# EAGLE design universal front plate final (EAGLE 7.6.0)
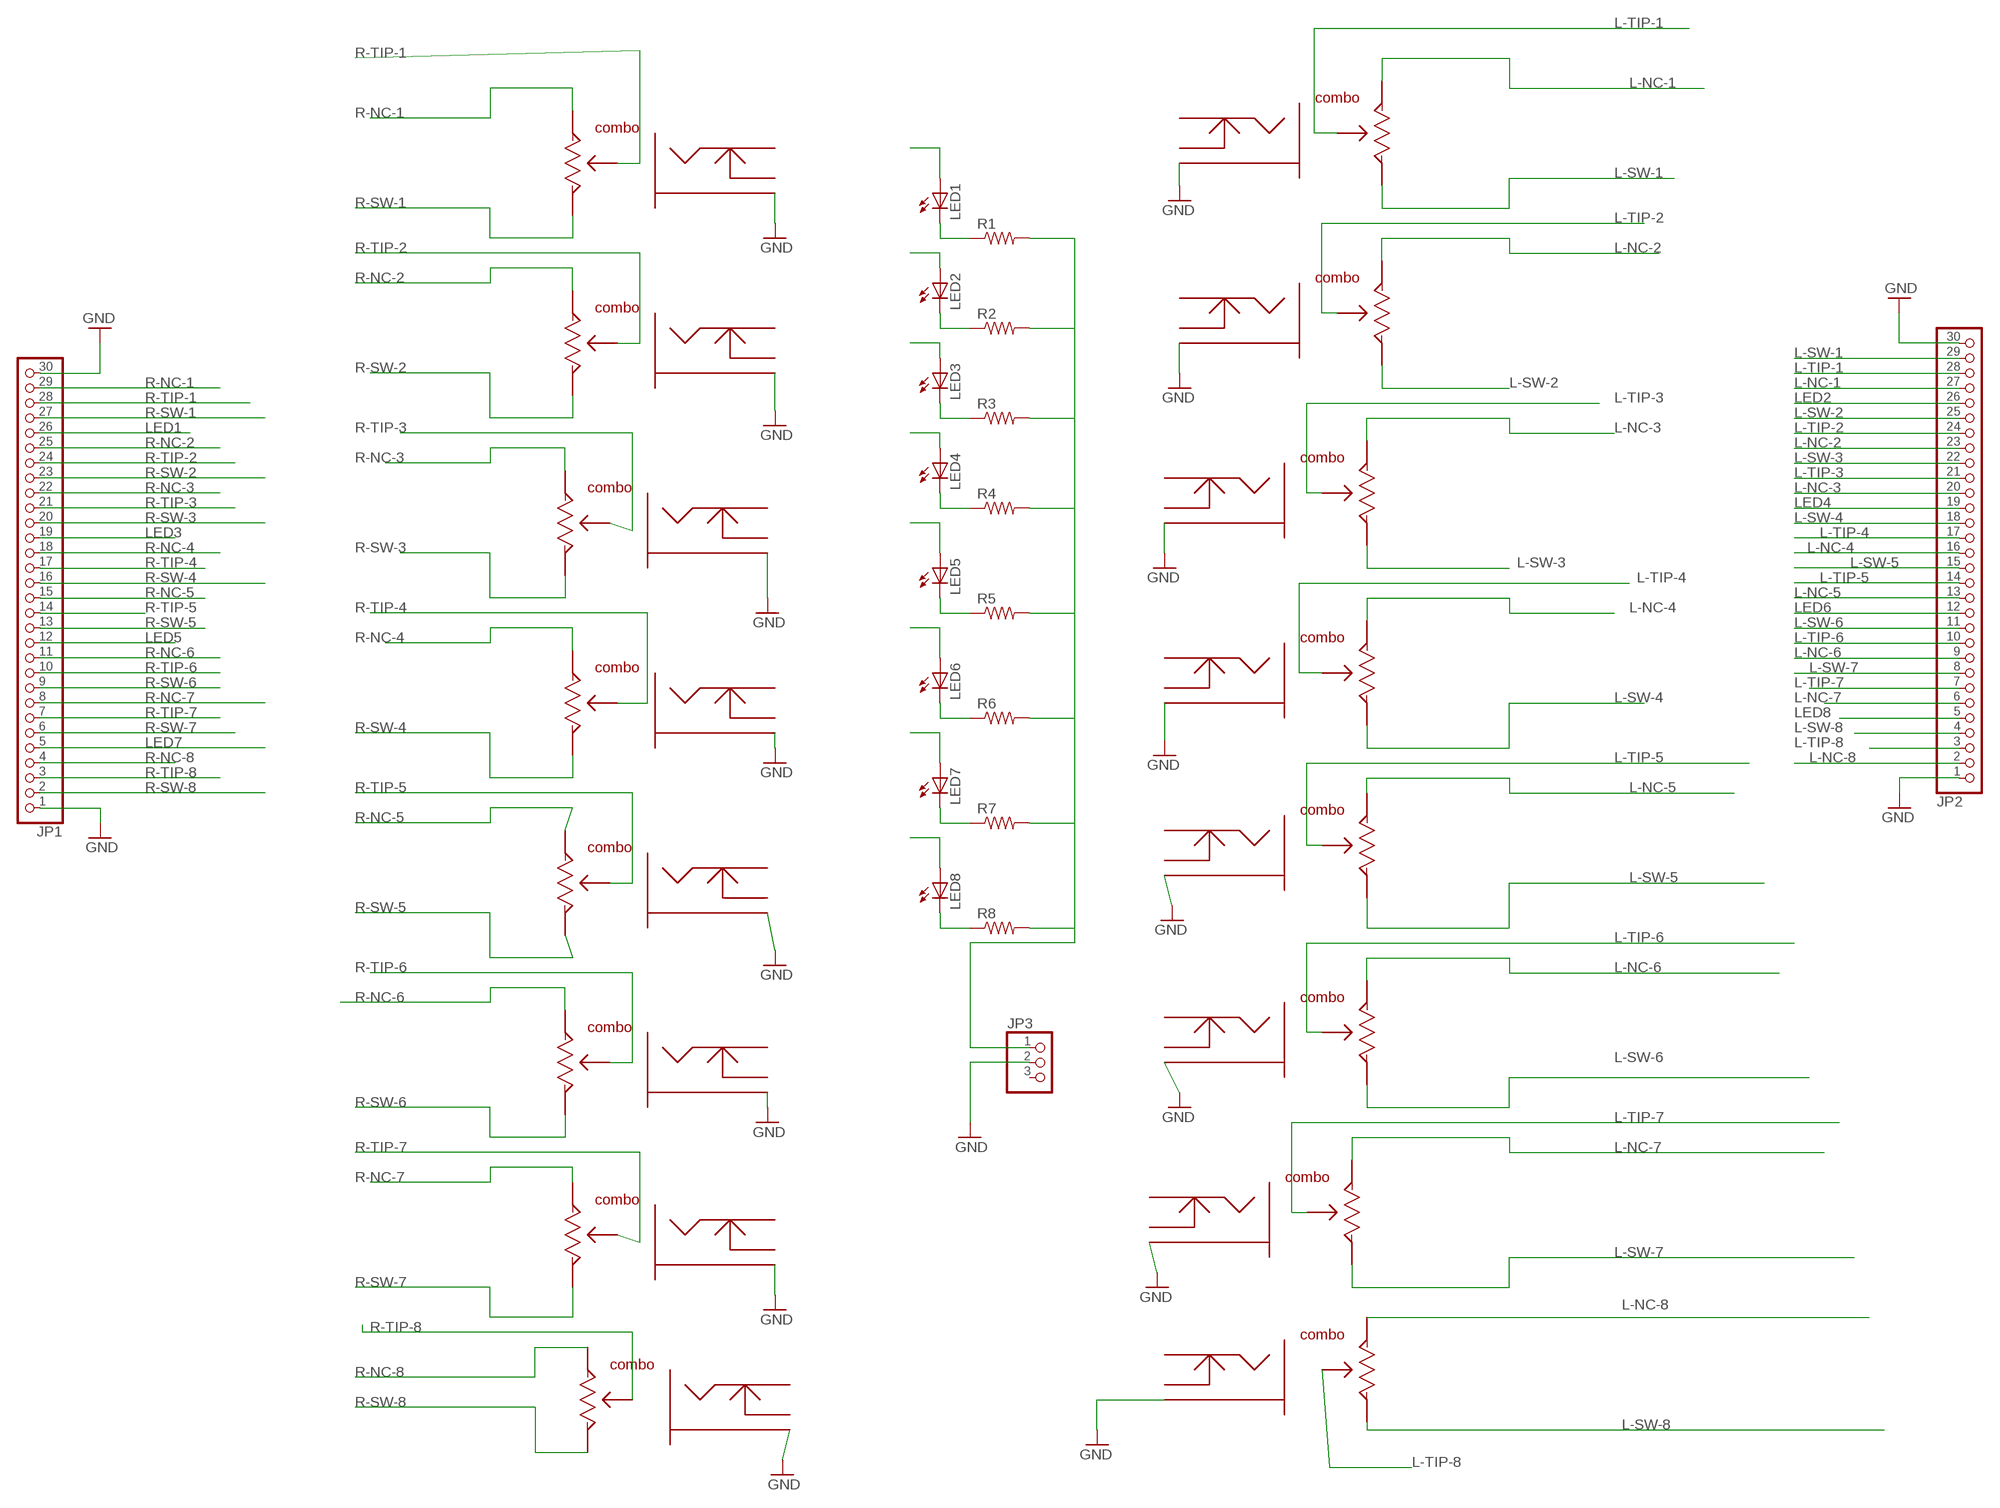
[diagram p0: schematic, sheet 1]

## Parts
JP1  PINHD-1X30  [1X30]
JP2  PINHD-1X30  [1X30]
JP3  PINHD-1X3  [1X03]
LED1  LED3MM  [LED3MM]
LED2  LED3MM  [LED3MM]
LED3  LED3MM  [LED3MM]
LED4  LED3MM  [LED3MM]
LED5  LED3MM  [LED3MM]
LED6  LED3MM  [LED3MM]
LED7  LED3MM  [LED3MM]
LED8  LED3MM  [LED3MM]
R1  R-US_0204/5  [0204/5]
R2  R-US_0204/5  [0204/5]
R3  R-US_0204/5  [0204/5]
R4  R-US_0204/5  [0204/5]
R5  R-US_0204/5  [0204/5]
R6  R-US_0204/5  [0204/5]
R7  R-US_0204/5  [0204/5]
R8  R-US_0204/5  [0204/5]
U$1  KOBICON-COMBO-NEW  [KOBICON-COMBO-NEW]
U$2  KOBICON-COMBO-NEW  [KOBICON-COMBO-NEW]
U$3  KOBICON-COMBO-NEW  [KOBICON-COMBO-NEW]
U$4  KOBICON-COMBO-NEW  [KOBICON-COMBO-NEW]
U$5  KOBICON-COMBO-NEW  [KOBICON-COMBO-NEW]
U$6  KOBICON-COMBO-NEW  [KOBICON-COMBO-NEW]
U$7  KOBICON-COMBO-NEW  [KOBICON-COMBO-NEW]
U$8  KOBICON-COMBO-NEW  [KOBICON-COMBO-NEW]
U$9  KOBICON-COMBO-NEW  [KOBICON-COMBO-NEW]
U$10  KOBICON-COMBO-NEW  [KOBICON-COMBO-NEW]
U$11  KOBICON-COMBO-NEW  [KOBICON-COMBO-NEW]
U$12  KOBICON-COMBO-NEW  [KOBICON-COMBO-NEW]
U$13  KOBICON-COMBO-NEW  [KOBICON-COMBO-NEW]
U$14  KOBICON-COMBO-NEW  [KOBICON-COMBO-NEW]
U$15  KOBICON-COMBO-NEW  [KOBICON-COMBO-NEW]
U$16  KOBICON-COMBO-NEW  [KOBICON-COMBO-NEW]

## Nets
GND: JP1.1 JP1.30 JP2.1 JP2.30 JP3.2 U$1.GND2(JACK-GND) U$1.GND(JACK-GND) U$2.GND2(JACK-GND) U$2.GND(JACK-GND) U$3.GND2(JACK-GND) U$3.GND(JACK-GND) U$4.GND2(JACK-GND) U$4.GND(JACK-GND) U$5.GND2(JACK-GND) U$5.GND(JACK-GND) U$6.GND2(JACK-GND) U$6.GND(JACK-GND) U$7.GND2(JACK-GND) U$7.GND(JACK-GND) U$8.GND2(JACK-GND) U$8.GND(JACK-GND) U$9.GND2(JACK-GND) U$9.GND(JACK-GND) U$10.GND2(JACK-GND) U$10.GND(JACK-GND) U$11.GND2(JACK-GND) U$11.GND(JACK-GND) U$12.GND2(JACK-GND) U$12.GND(JACK-GND) U$13.GND2(JACK-GND) U$13.GND(JACK-GND) U$14.GND2(JACK-GND) U$14.GND(JACK-GND) U$15.GND2(JACK-GND) U$15.GND(JACK-GND) U$16.GND2(JACK-GND) U$16.GND(JACK-GND)
L-NC-1: JP2.27 U$8.JACK-MID(POT-L) U$8.POT-L
L-NC-2: JP2.23 U$9.JACK-MID(POT-L) U$9.POT-L
L-NC-3: JP2.20 U$10.JACK-MID(POT-L) U$10.POT-L
L-NC-4: JP2.16 U$11.JACK-MID(POT-L) U$11.POT-L
L-NC-5: JP2.13 U$12.JACK-MID(POT-L) U$12.POT-L
L-NC-6: JP2.9 U$13.JACK-MID(POT-L) U$13.POT-L
L-NC-7: JP2.6 U$14.JACK-MID(POT-L) U$14.POT-L
L-NC-8: JP2.2 U$15.JACK-MID(POT-L) U$15.POT-L
L-SW-1: JP2.29 U$8.JACK-BOT(POT-R) U$8.POT-R
L-SW-2: JP2.25 U$9.JACK-BOT(POT-R) U$9.POT-R
L-SW-3: JP2.22 U$10.JACK-BOT(POT-R) U$10.POT-R
L-SW-4: JP2.18 U$11.JACK-BOT(POT-R) U$11.POT-R
L-SW-5: JP2.15 U$12.JACK-BOT(POT-R) U$12.POT-R
L-SW-6: JP2.11 U$13.JACK-BOT(POT-R) U$13.POT-R
L-SW-7: JP2.8 U$14.JACK-BOT(POT-R) U$14.POT-R
L-SW-8: JP2.4 U$15.JACK-BOT(POT-R) U$15.POT-R
L-TIP-1: JP2.28 U$8.JACK-TOP(POT-MID) U$8.POT-MID
L-TIP-2: JP2.24 U$9.JACK-TOP(POT-MID) U$9.POT-MID
L-TIP-3: JP2.21 U$10.JACK-TOP(POT-MID) U$10.POT-MID
L-TIP-4: JP2.17 U$11.JACK-TOP(POT-MID) U$11.POT-MID
L-TIP-5: JP2.14 U$12.JACK-TOP(POT-MID) U$12.POT-MID
L-TIP-6: JP2.10 U$13.JACK-TOP(POT-MID) U$13.POT-MID
L-TIP-7: JP2.7 U$14.JACK-TOP(POT-MID) U$14.POT-MID
L-TIP-8: JP2.3 U$15.JACK-TOP(POT-MID) U$15.POT-MID
LED1: JP1.26 LED1.A
LED2: JP2.26 LED2.A
LED3: JP1.19 LED3.A
LED4: JP2.19 LED4.A
LED5: JP1.12 LED5.A
LED6: JP2.12 LED6.A
LED7: JP1.5 LED7.A
LED8: JP2.5 LED8.A
N$1: LED8.K(C) R8.1
N$3: JP3.1 R1.2 R2.2 R3.2 R4.2 R5.2 R6.2 R7.2 R8.2
N$22: LED1.K(C) R1.1
N$30: LED2.K(C) R2.1
N$32: LED3.K(C) R3.1
N$33: LED4.K(C) R4.1
N$36: LED5.K(C) R5.1
N$38: LED6.K(C) R6.1
N$40: LED7.K(C) R7.1
R-NC-1: JP1.29 U$1.JACK-MID(POT-L) U$1.POT-L
R-NC-2: JP1.25 U$2.JACK-MID(POT-L) U$2.POT-L
R-NC-3: JP1.22 U$3.JACK-MID(POT-L) U$3.POT-L
R-NC-4: JP1.18 U$4.JACK-MID(POT-L) U$4.POT-L
R-NC-5: JP1.15 U$5.JACK-MID(POT-L) U$5.POT-L
R-NC-6: JP1.11 U$6.JACK-MID(POT-L) U$6.POT-L
R-NC-7: JP1.8 U$7.JACK-MID(POT-L) U$7.POT-L
R-NC-8: JP1.4 U$16.JACK-MID(POT-L) U$16.POT-L
R-SW-1: JP1.27 U$1.JACK-BOT(POT-R) U$1.POT-R
R-SW-2: JP1.23 U$2.JACK-BOT(POT-R) U$2.POT-R
R-SW-3: JP1.20 U$3.JACK-BOT(POT-R) U$3.POT-R
R-SW-4: JP1.16 U$4.JACK-BOT(POT-R) U$4.POT-R
R-SW-5: JP1.13 U$5.JACK-BOT(POT-R) U$5.POT-R
R-SW-6: JP1.9 U$6.JACK-BOT(POT-R) U$6.POT-R
R-SW-7: JP1.6 U$7.JACK-BOT(POT-R) U$7.POT-R
R-SW-8: JP1.2 U$16.JACK-BOT(POT-R) U$16.POT-R
R-TIP-1: JP1.28 U$1.JACK-TOP(POT-MID) U$1.POT-MID
R-TIP-2: JP1.24 U$2.JACK-TOP(POT-MID) U$2.POT-MID
R-TIP-3: JP1.21 U$3.JACK-TOP(POT-MID) U$3.POT-MID
R-TIP-4: JP1.17 U$4.JACK-TOP(POT-MID) U$4.POT-MID
R-TIP-5: JP1.14 U$5.JACK-TOP(POT-MID) U$5.POT-MID
R-TIP-6: JP1.10 U$6.JACK-TOP(POT-MID) U$6.POT-MID
R-TIP-7: JP1.7 U$7.JACK-TOP(POT-MID) U$7.POT-MID
R-TIP-8: JP1.3 U$16.JACK-TOP(POT-MID) U$16.POT-MID
Unconnected: JP3.3

## Library data of the parts
JP1 JP2 = pinhead:PINHD-1X30: PIN HEADER
JP3 = pinhead:PINHD-1X3: PIN HEADER
LED1-LED8 = led:LED: LED OSRAM: - CHIPLED LG R971, LG N971, LY N971, LG Q971, LY Q971, LO R971, LY R971 LH N974, LH R974 LS Q976, LO Q976, LY Q976 LO Q996 - Hyper CHIPLED LW Q18S LB Q993, LB Q99A, LB R99A - SideLED LS A670, LO A670, LY A670, LG A670, LP A670 LB A673, LV A673, LT A673, LW A673 LH A674 LY A675 LS A676, LA A676, LO A676, LY A676, LW A676 LS A679, LY A679, LG A679 - Hyper Micro SIDELED® LS Y876, LA Y876, LO Y876, LY Y876 LT Y87S - SmartLED LW L88C, LW L88S LB L89C, LB L89S, LG L890 LS L89K, LO L89K, LY L89K LS L896, LA L896, LO L896, LY L896 - TOPLED LS T670, LO T670, LY T670, LG T670, LP T670 LSG T670, LSP T670, LSY T670, LOP T670, LYG T670 LG T671, LOG T671, LSG T671 LB T673, LV T673, LT T673, LW T673 LH T674 LS T676, LA T676, LO T676, LY T676, LB T676, LH T676, LSB T676, LW T676 LB T67C, LV T67C, LT T67C, LS T67K, LO T67K, LY T67K, LW E67C LS E67B, LA E67B, LO E67B, LY E67B, LB E67C, LV E67C, LT E67C LW T67C LS T679, LY T679, LG T679 LS T770, LO T770, LY T770, LG T770, LP T770 LB T773, LV T773, LT T773, LW T773 LH T774 LS E675, LA E675, LY E675, LS T675 LS T776, LA T776, LO T776, LY T776, LB T776 LHGB T686 LT T68C, LB T68C - Hyper Mini TOPLED® LB M676 - Mini TOPLED Santana® LG M470 LS M47K, LO M47K, LY M47K Source: http://www.osram.convergy.de LUXEON: - LUMILED® LXK2-PW12-R00, LXK2-PW12-S00, LXK2-PW14-U00, LXK2-PW14-V00 LXK2-PM12-R00, LXK2-PM12-S00, LXK2-PM14-U00 LXK2-PE12-Q00, LXK2-PE12-R00, LXK2-PE12-S00, LXK2-PE14-T00, LXK2-PE14-U00 LXK2-PB12-K00, LXK2-PB12-L00, LXK2-PB12-M00, LXK2-PB14-N00, LXK2-PB14-P00, LXK2-PB14-Q00 LXK2-PR12-L00, LXK2-PR12-M00, LXK2-PR14-Q00, LXK2-PR14-R00 LXK2-PD12-Q00, LXK2-PD12-R00, LXK2-PD12-S00 LXK2-PH12-R00, LXK2-PH12-S00 LXK2-PL12-P00, LXK2-PL12-Q00, LXK2-PL12-R00 Source: www.luxeon.com KINGBRIGHT: KA-3528ASYC Source: www.kingbright.com
R1-R8 = rcl:R-US_: RESISTOR, American symbol
U$1-U$16 = elipech_modified:KOBICON-COMBO-NEW

## Board
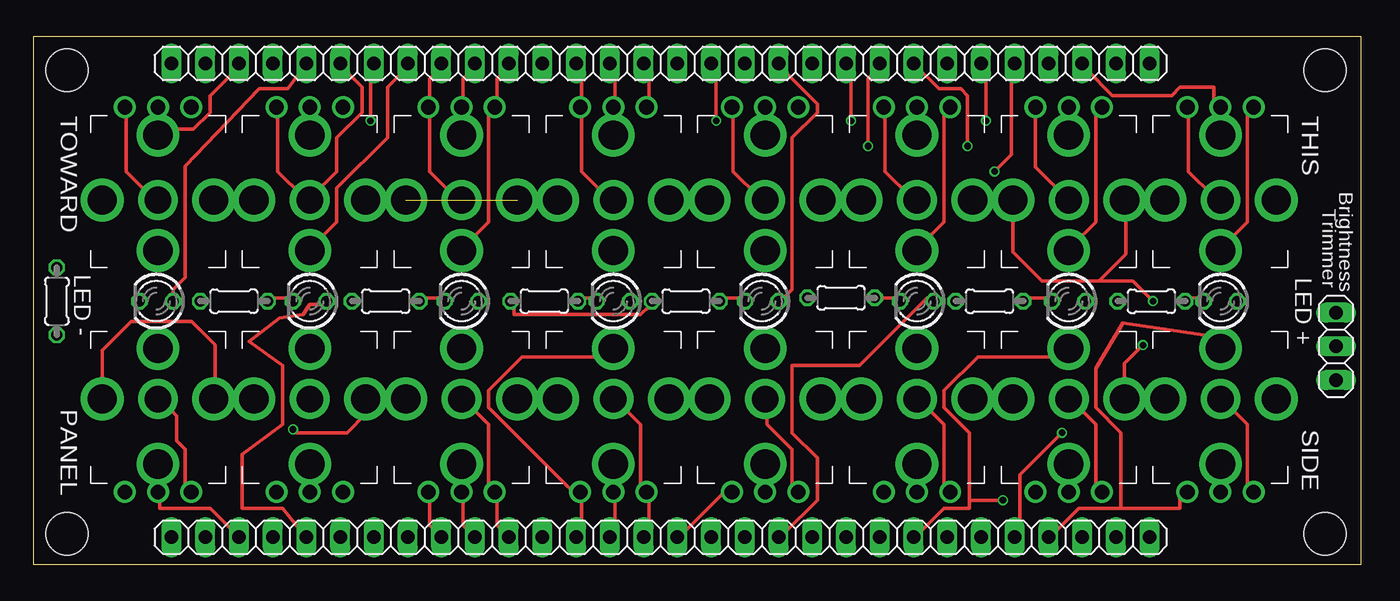
[diagram p1: board, top side]
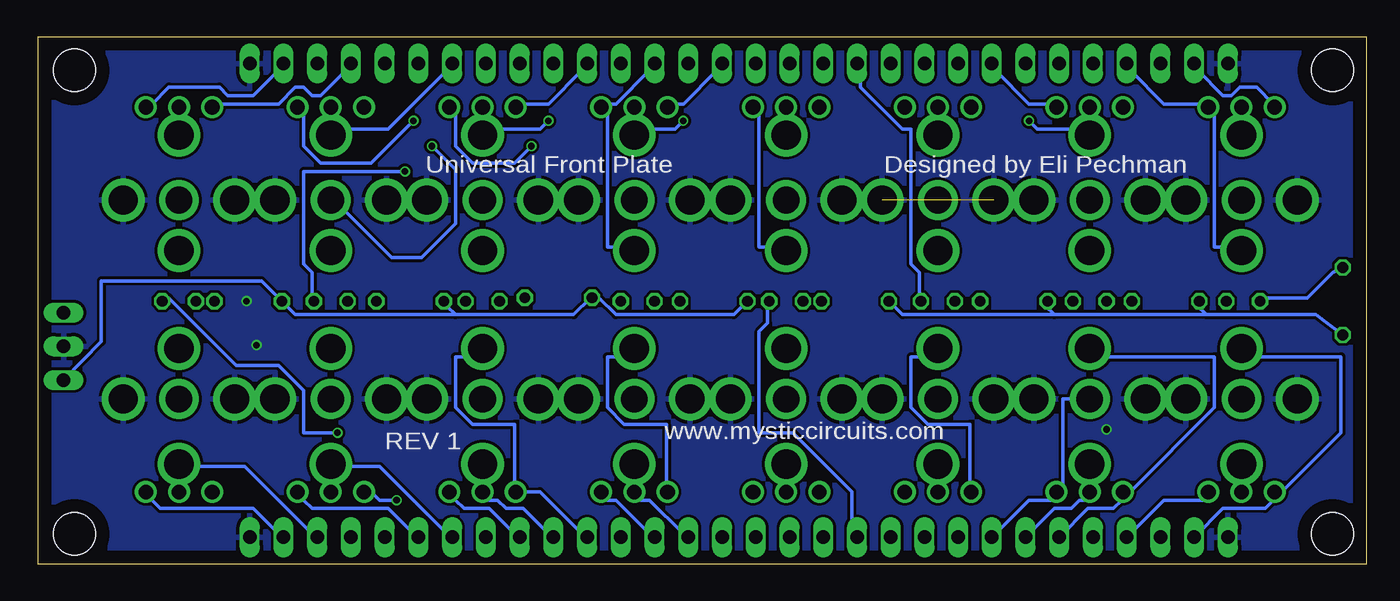
[diagram p2: board, bottom side, seen from below]

Size 100 x 39.75 mm. Coordinates in mm from the lower left corner, seen from the top.
Outline: 0,0 100,0 100,39.75 0,39.75 0,0
Copper layers (1*16): Top 0.035mm / dielectric 1.5mm / Bottom 0.035mm
Design rules "default *": minimum track width 10mil, minimum drill 24mil, track to track 8mil, track to pad 8mil, pad to pad 8mil, via to via 8mil, smd to smd 8mil, copper to edge 40mil, drill to drill 10mil, minimum pad ring 0mil, minimum via ring 0mil, stop-mask expansion 4mil, vias tented up to drill 20mil, thermal gap 10mil
Holes 3.2 mm at 2.54,37.21 2.54,2.29 97.28,2.29 97.28,37.21

### Footprints (pad centres in the part's own frame; a part is rotated, then mirrored left to right if it is on the bottom)
1X30 = drill 1.016 long: 1 -36.83,0; 2 -34.29,0; 3 -31.75,0; 4 -29.21,0; 5 -26.67,0; 6 -24.13,0; 7 -21.59,0; 8 -19.05,0; 9 -16.51,0; 10 -13.97,0; 11 -11.43,0; 12 -8.89,0; 13 -6.35,0; 14 -3.81,0; 15 -1.27,0; 16 1.27,0; 17 3.81,0; 18 6.35,0; 19 8.89,0; 20 11.43,0; 21 13.97,0; 22 16.51,0; 23 19.05,0; 24 21.59,0; 25 24.13,0; 26 26.67,0; 27 29.21,0; 28 31.75,0; 29 34.29,0; 30 36.83,0
1X03 = drill 1.016 long: 1 -2.54,0; 2 0,0; 3 2.54,0
LED3MM = drill 0.813 octagon: A -1.27,0; K 1.27,0
0204/5 = drill 0.813 octagon: 1 -2.54,0; 2 2.54,0
KOBICON-COMBO-NEW = drill 2.2: GND -4.2,0; GND2 4.2,0; JACK-BOT 0,-3.8; JACK-TOP 0,4.9 | drill 2: JACK-MID 0,0 | drill 1.1: POT-L -2.5,7; POT-MID 0,7; POT-R 2.5,7

### Placement (x,y rotation side)
JP1  47.24,2.03 0 top
JP2  47.24,37.72 0 top
JP3  98.1,16.42 90 top
LED1  89.41,19.81 180 top
LED2  77.98,19.81 180 top
LED3  66.55,19.81 180 top
LED4  54.86,19.81 180 top
LED5  43.69,19.81 180 top
LED6  32.26,19.81 180 top
LED7  20.83,19.81 180 top
LED8  9.27,19.81 180 top
R1  84.2,19.81 180 top
R2  72.01,19.81 180 top
R3  60.83,20.07 180 top
R4  49.15,19.81 180 top
R5  38.48,19.81 180 top
R6  26.54,19.81 180 top
R7  15.11,19.81 180 top
R8  1.78,19.81 270 top
U$1  89.41,12.45 180 top
U$2  77.98,12.45 180 top
U$3  66.55,12.45 180 top
U$4  55.12,12.45 180 top
U$5  43.69,12.45 180 top
U$6  32.26,12.45 180 top
U$7  20.83,12.45 180 top
U$8  89.41,27.43 0 top
U$9  77.98,27.43 0 top
U$10  66.55,27.43 0 top
U$11  55.12,27.43 0 top
U$12  43.69,27.43 0 top
U$13  32.26,27.43 0 top
U$14  20.83,27.43 0 top
U$15  9.4,27.43 0 top
U$16  9.4,12.45 180 top

### Tracks (layer width: path | path; a pad name or v marks a point on that pad's centre or on a via)
GND  (via drill 0.5)  (1 unrouted)
  Top 0.254: U$16.GND2 5.2,16.12 7.37,18.29 11.94,18.29 13.72,16.51 13.72,12.56 U$16.GND | U$9.GND 73.78,23.5 75.95,21.34 80.26,21.34 | 80.26,21.34 82.3,23.37 82.3,27.31 U$9.GND2 | U$2.GND 82.18,15.12 v83.57,16.51 | 80.26,21.34 82.8,21.34 v84.33,19.81 | U$7.GND 25.03,11.31 23.62,9.91 19.81,9.91 v19.56,10.16
  pour Bottom: 101.6,-2.79 -2.54,-2.79 -2.29,42.16 101.6,42.93
L-NC-1
  Top 0.254: U$8.JACK-MID 88.9,27.69 87,29.59 87,34.04 U$8.POT-L
  Bottom 0.254: U$8.POT-L 86.36,34.67 81.92,34.67 80.64,35.94 80.01,35.94 79.38,35.31 78.74,35.31 76.83,37.21 JP2.27
L-NC-2  (via drill 0.5)
  Top 0.254: U$9.POT-L 75.48,29.93 U$9.JACK-MID | v70.36,31.5 70.36,35.31 69.85,35.81 68.2,35.81 JP2.23
  Bottom 0.254: 77.72,27.43 77.41,27.11 | 77.41,27.11 73.41,23.11 71.12,23.11 68.58,25.65 68.58,29.72 v70.36,31.5 | U$9.JACK-MID 77.47,27.05 77.41,27.11
L-NC-3
  Top 0.254: U$10.JACK-MID 66.04,27.69 64.14,29.59 64.14,34.04 U$10.POT-L
  Bottom 0.254: JP2.20 59.05,37.21 61.59,34.67 63.5,34.67 U$10.POT-L
L-NC-4
  Top 0.254: U$11.POT-L 52.7,34.04 52.7,29.59 54.61,27.69 U$11.JACK-MID
  Bottom 0.254: JP2.16 48.9,37.21 51.44,34.67 52.07,34.67 U$11.POT-L
L-NC-5
  Top 0.254: U$12.JACK-MID 43.18,27.69 41.27,29.59 41.27,34.04 U$12.POT-L 41.27,34.67 41.27,37.21 JP2.13
L-NC-6
  Top 0.254: U$13.JACK-MID 31.75,27.69 29.84,29.59 29.84,34.04 U$13.POT-L 29.84,34.67 29.84,36.58 30.48,37.21 JP2.9
L-NC-7
  Top 0.254: U$14.POT-L 18.41,34.04 18.41,29.59 20.32,27.69 U$14.JACK-MID 20.95,27.69 22.86,29.59 22.86,32.13 24.77,34.04 24.77,35.94 23.5,37.21 JP2.6
L-NC-8
  Top 0.254: U$15.JACK-MID 8.89,27.69 6.99,29.59 6.99,34.04 U$15.POT-L
  Bottom 0.254: JP2.2 12.7,37.21 10.79,35.31 10.16,35.31 9.53,35.94 8.26,35.94 6.99,34.67 U$15.POT-L
L-SW-1
  Top 0.254: U$8.JACK-BOT 89.53,23.88 91.44,25.78 91.44,34.04 U$8.POT-R
  Bottom 0.254: U$8.POT-R 91.44,34.67 90.17,35.94 86.36,35.94 85.72,35.31 83.82,35.31 81.92,37.21 JP2.29
L-SW-2  (via drill 0.5)
  Top 0.254: U$9.JACK-BOT 78.11,23.88 80.01,25.78 80.01,34.04 U$9.POT-R | v71.75,33.4 71.75,37.21 JP2.25
  Bottom 0.254: v71.75,33.4 74.93,30.23 78.74,30.23 80.01,31.5 80.01,34.04 U$9.POT-R
L-SW-3  (via drill 0.5)
  Top 0.254: U$10.JACK-BOT 66.67,23.88 68.58,25.78 68.58,34.04 U$10.POT-R | v62.87,31.5 62.87,36.58 63.5,37.21 JP2.22
  Bottom 0.254: v62.87,31.5 64.14,30.23 67.31,30.23 68.58,31.5 68.58,34.04 U$10.POT-R
L-SW-4
  Bottom 0.254: U$11.JACK-BOT 55.24,23.88 57.15,23.88 57.15,34.04 U$11.POT-R 57.15,34.67 56.52,34.67 53.98,37.21 JP2.18
L-SW-5
  Top 0.254: JP2.15 46.35,37.21 46.35,34.67 U$12.POT-R
  Bottom 0.254: U$12.POT-R 45.72,34.04 45.72,23.88 43.81,23.88 U$12.JACK-BOT
L-SW-6
  Top 0.254: U$13.JACK-BOT 32.38,23.88 34.29,25.78 34.29,34.04 U$13.POT-R 34.92,34.67 34.92,36.58 35.56,37.21 JP2.11
L-SW-7
  Top 0.254: JP2.8 27.94,37.21 26.67,35.94 26.67,32.13 22.86,28.32 22.86,25.78 20.95,23.88 U$14.JACK-BOT
  Bottom 0.254: JP2.8 27.94,37.21 25.4,34.67 23.5,34.67 U$14.POT-R
L-SW-8
  Bottom 0.254: U$15.JACK-BOT 9.53,23.88 11.43,23.88 11.43,34.04 U$15.POT-R 12.06,34.67 15.24,34.67 17.78,37.21 JP2.4
L-TIP-1
  Top 0.254: U$8.JACK-TOP 89.53,32.77 89.53,34.04 U$8.POT-MID 88.9,34.67 88.9,35.94 86.36,35.94 85.72,35.31 81.28,35.31 79.38,37.21 JP2.28
L-TIP-2
  Top 0.254: U$9.POT-MID 78.11,34.04 78.11,32.77 U$9.JACK-TOP
  Bottom 0.254: JP2.24 69.22,37.21 73.66,32.77 77.47,32.77 U$9.JACK-TOP
L-TIP-3  (via drill 0.5)
  Top 0.254: U$10.POT-MID 66.67,34.04 66.67,32.77 U$10.JACK-TOP | v61.59,33.4 61.59,37.21 JP2.21
  Bottom 0.254: v61.59,33.4 62.23,32.77 66.04,32.77 U$10.JACK-TOP
L-TIP-4  (via drill 0.5)
  Top 0.254: U$11.POT-MID 55.24,34.04 55.24,32.77 U$11.JACK-TOP | v51.44,33.4 51.44,37.21 JP2.17
  Bottom 0.254: v51.44,33.4 52.07,32.77 54.61,32.77 U$11.JACK-TOP
L-TIP-5
  Top 0.254: U$12.JACK-TOP 43.81,32.77 43.81,34.04 U$12.POT-MID 43.81,34.67 43.81,37.21 JP2.14
L-TIP-6
  Top 0.254: U$13.JACK-TOP 32.38,32.77 32.38,34.04 U$13.POT-MID 32.38,34.67 32.38,36.58 33.02,37.21 JP2.10
L-TIP-7  (via drill 0.5)
  Top 0.254: U$14.POT-MID 20.95,34.04 20.95,32.77 U$14.JACK-TOP | v25.4,33.4 25.4,37.21 JP2.7
  Bottom 0.254: v25.4,33.4 24.77,32.77 20.95,32.77 U$14.JACK-TOP
L-TIP-8
  Top 0.254: 9.53,32.77 12.06,32.77 13.34,34.04 13.34,35.31 15.24,37.21 JP2.3 | 9.53,32.77 9.53,34.04 U$15.POT-MID | 9.53,32.77 U$15.JACK-TOP
LED1  (via drill 0.5)
  Top 0.254: v77.47,9.91 74.3,6.73 74.3,2.29 JP1.26
  Bottom 0.254: v77.47,9.91 80.01,9.91 80.01,13.08 81.92,14.99 85.09,14.99 90.17,20.07 LED1.A
LED2  (via drill 0.5)
  Top 0.254: v72.39,29.59 73.66,30.86 73.66,37.21 JP2.26
  Bottom 0.254: v72.39,29.59 80.01,29.59 80.01,22.61 79.38,21.97 79.38,20.07 LED2.A
LED3
  Top 0.254: LED3.A 67.31,20.07 62.23,14.99 57.15,14.99 57.15,9.91 59.05,8 59.05,4.83 56.52,2.29 JP1.19
LED4
  Top 0.254: LED4.A 56.52,20.07 57.15,20.7 57.15,32.13 59.05,34.04 59.05,34.67 56.52,37.21 JP2.19
LED5
  Bottom 0.254: LED5.A 45.09,19.43 45.09,18.16 45.72,17.53 45.72,9.91 43.18,9.91 38.73,5.46 38.73,2.29 JP1.12
LED6
  Bottom 0.254: LED6.A 33.66,20.07 33.66,21.97 34.29,22.61 34.29,32.77 34.92,32.77 38.1,35.94 38.1,37.21 JP2.12
LED7
  Top 0.254: LED7.A 21.59,19.56 20.83,19.56 20.32,18.8 18.54,18.54 16.26,16.76 18.8,14.99 18.8,10.54 15.75,8.26 15.75,4.19 18.8,4.19 20.32,2.29 JP1.5
LED8
  Top 0.254: LED8.A 10.54,20.7 11.43,21.59 11.43,29.97 17.02,35.81 19.18,35.81 JP2.5
N$1
  Bottom 0.254: R8.1 2.54,21.97 4.45,20.07 7.62,20.07 LED8.K
N$3
  Top 0.254: R4.2 46.35,19.43 45.72,18.8 36.2,18.8 36.2,19.43 R5.2
  Bottom 0.254: 68.58,18.8 69.22,19.43 R2.2 | 68.58,18.8 59.69,18.8 58.42,20.07 R3.2 57.78,20.07 56.52,18.8 47.62,18.8 R4.2 | 68.58,18.8 80.64,18.8 R1.2 83.19,21.34 95.25,21.34 95.25,16.76 JP3.1 | R8.2 3.81,18.8 12.06,18.8 | 12.06,18.8 12.7,19.43 R7.2 | 23.5,18.8 24.13,19.43 R6.2 | 12.06,18.8 23.5,18.8 | R5.2 34.92,18.8 23.5,18.8
N$22
  Top 0.254: R1.1 87,20.07 87.63,20.07 LED1.K
N$30
  Top 0.254: R2.1 74.93,20.07 76.2,20.07 LED2.K
N$32
  Top 0.254: R3.1 64.77,20.07 LED3.K
N$33
  Top 0.254: R4.1 52.07,20.07 53.34,20.07 LED4.K
N$36
  Top 0.254: R5.1 41.27,20.07 41.91,20.07 LED5.K
N$38
  Top 0.254: R6.1 29.21,20.07 30.48,20.07 LED6.K
N$40
  Top 0.254: R7.1 17.78,20.07 19.05,20.07 LED7.K
R-NC-1
  Top 0.254: U$1.JACK-MID 89.53,12.45 91.44,10.54 91.44,5.46 U$1.POT-L
  Bottom 0.254: JP1.29 81.92,2.29 83.82,4.19 90.81,4.19 91.44,4.83 U$1.POT-L
R-NC-2
  Top 0.254: U$2.JACK-MID 78.11,12.45 80.01,10.54 80.01,5.46 U$2.POT-L
  Bottom 0.254: JP1.25 71.75,2.29 73.66,4.19 79.38,4.19 80.01,4.83 U$2.POT-L
R-NC-3
  Top 0.254: U$3.JACK-MID 66.67,12.45 68.58,10.54 68.58,5.46 U$3.POT-L
  Bottom 0.254: JP1.22 64.14,2.29 66.04,4.19 67.94,4.19 68.58,4.83 U$3.POT-L
R-NC-4
  Top 0.254: U$4.POT-L 57.15,5.46 57.15,8.64 55.24,10.54 55.24,12.45 U$4.JACK-MID
  Bottom 0.254: JP1.18 53.98,2.29 56.52,4.83 57.15,4.83 U$4.POT-L
R-NC-5
  Top 0.254: U$5.JACK-MID 43.81,12.45 45.72,10.54 45.72,5.46 U$5.POT-L 46.35,4.83 46.35,2.29 JP1.15
R-NC-6
  Top 0.254: U$6.JACK-MID 32.38,12.45 34.29,10.54 34.29,5.46 U$6.POT-L 34.92,4.83 34.92,2.92 JP1.11
R-NC-7
  Bottom 0.254: U$7.JACK-MID 22.86,12.45 22.86,5.46 U$7.POT-L 23.5,4.83 25.4,4.83 JP1.8
R-NC-8
  Top 0.254: U$16.JACK-MID 9.53,12.45 10.79,11.18 10.79,9.27 11.43,8.64 11.43,5.46 U$16.POT-L
  Bottom 0.254: JP1.4 15.24,4.83 12.06,4.83 U$16.POT-L
R-SW-1
  Top 0.254: 81.92,4.19 86.36,4.19 86.36,5.46 U$1.POT-R | 81.92,4.19 78.74,4.19 76.83,2.29 JP1.27 | 81.92,4.19 81.92,9.91 80.01,11.81 80.01,14.73 82.04,18.16 88.9,17.14 U$1.JACK-BOT
R-SW-2  (via drill 0.5)
  Top 0.254: 70.48,4.83 70.48,9.91 68.58,11.81 68.58,13.08 71.12,15.62 77.47,15.62 U$2.JACK-BOT | 70.48,4.83 70.48,4.19 68.58,4.19 66.67,2.29 JP1.23 | 70.48,4.83 v73.03,4.83
  Bottom 0.254: v73.03,4.83 74.3,4.83 74.93,5.46 U$2.POT-R
R-SW-3
  Bottom 0.254: U$3.JACK-BOT 66.67,15.62 68.58,15.62 68.58,11.81 67.31,10.54 64.14,10.54 64.14,5.46 U$3.POT-R 63.5,5.46 62.23,5.46 59.05,2.29 JP1.20
R-SW-4
  Top 0.254: JP1.16 48.9,2.29 52.07,5.46 U$4.POT-R
  Bottom 0.254: U$4.POT-R 52.7,5.46 52.7,10.54 55.88,10.54 57.15,11.81 57.15,15.62 55.24,15.62 U$4.JACK-BOT
R-SW-5
  Top 0.254: U$5.JACK-BOT 43.18,15.62 36.83,15.62 34.29,13.08 34.29,11.81 40.64,5.46 U$5.POT-R 41.27,4.83 41.27,2.29 JP1.13
R-SW-6
  Top 0.254: JP1.9 29.84,2.92 29.84,4.83 U$6.POT-R
  Bottom 0.254: U$6.POT-R 29.84,5.46 29.84,10.54 33.02,10.54 34.29,11.81 34.29,15.62 32.38,15.62 U$6.JACK-BOT
R-SW-7
  Bottom 0.254: U$7.JACK-BOT 20.32,15.62 11.43,15.62 11.43,11.81 17.78,5.46 U$7.POT-R 18.41,4.83 19.05,4.19 20.95,4.19 JP1.6
R-SW-8
  Bottom 0.254: U$16.JACK-BOT 8.89,15.62 1.91,15.62 1.91,9.91 6.35,5.46 U$16.POT-R 6.99,4.83 7.62,4.19 10.79,4.19 JP1.2
R-TIP-1
  Top 0.254: U$1.POT-MID 89.53,5.46 89.53,7.37 U$1.JACK-TOP
  Bottom 0.254: JP1.28 79.38,2.29 84.45,7.37 88.9,7.37 U$1.JACK-TOP
R-TIP-2
  Top 0.254: U$2.POT-MID 78.11,5.46 78.11,7.37 U$2.JACK-TOP
  Bottom 0.254: JP1.24 69.22,2.29 74.3,7.37 77.47,7.37 U$2.JACK-TOP
R-TIP-3
  Top 0.254: U$3.POT-MID 66.67,5.46 66.67,7.37 U$3.JACK-TOP
  Bottom 0.254: JP1.21 61.59,2.29 63.5,4.19 64.77,4.19 65.41,4.83 66.04,4.83 U$3.POT-MID
R-TIP-4
  Top 0.254: U$4.POT-MID 55.24,5.46 55.24,7.37 U$4.JACK-TOP
  Bottom 0.254: JP1.17 51.44,2.29 53.98,4.83 54.61,4.83 U$4.POT-MID
R-TIP-5
  Top 0.254: U$5.JACK-TOP 43.81,7.37 43.81,5.46 U$5.POT-MID 43.81,4.83 43.81,2.29 JP1.14
R-TIP-6
  Top 0.254: U$6.JACK-TOP 32.38,7.37 32.38,5.46 U$6.POT-MID 32.38,4.83 32.38,2.92 JP1.10
R-TIP-7
  Top 0.254: U$7.POT-MID 20.95,5.46 20.95,7.37 U$7.JACK-TOP
  Bottom 0.254: JP1.7 23.5,4.19 22.23,4.19 21.59,4.83 20.95,4.83 U$7.POT-MID
R-TIP-8
  Top 0.254: U$16.JACK-TOP 9.53,7.37 9.53,5.46 U$16.POT-MID 9.53,4.83 9.53,4.19 13.34,4.19 JP1.3

### Text on the board
tPlace: TOWARD | THIS | LED - | LED + | Trimmer | Brightness | PANEL | SIDE
bPlace: Designed by Eli Pechman | Universal Front Plate | www.mysticcircuits.com | REV 1